# EAGLE schematic Keyboard Controller (EAGLE 9.6.2)
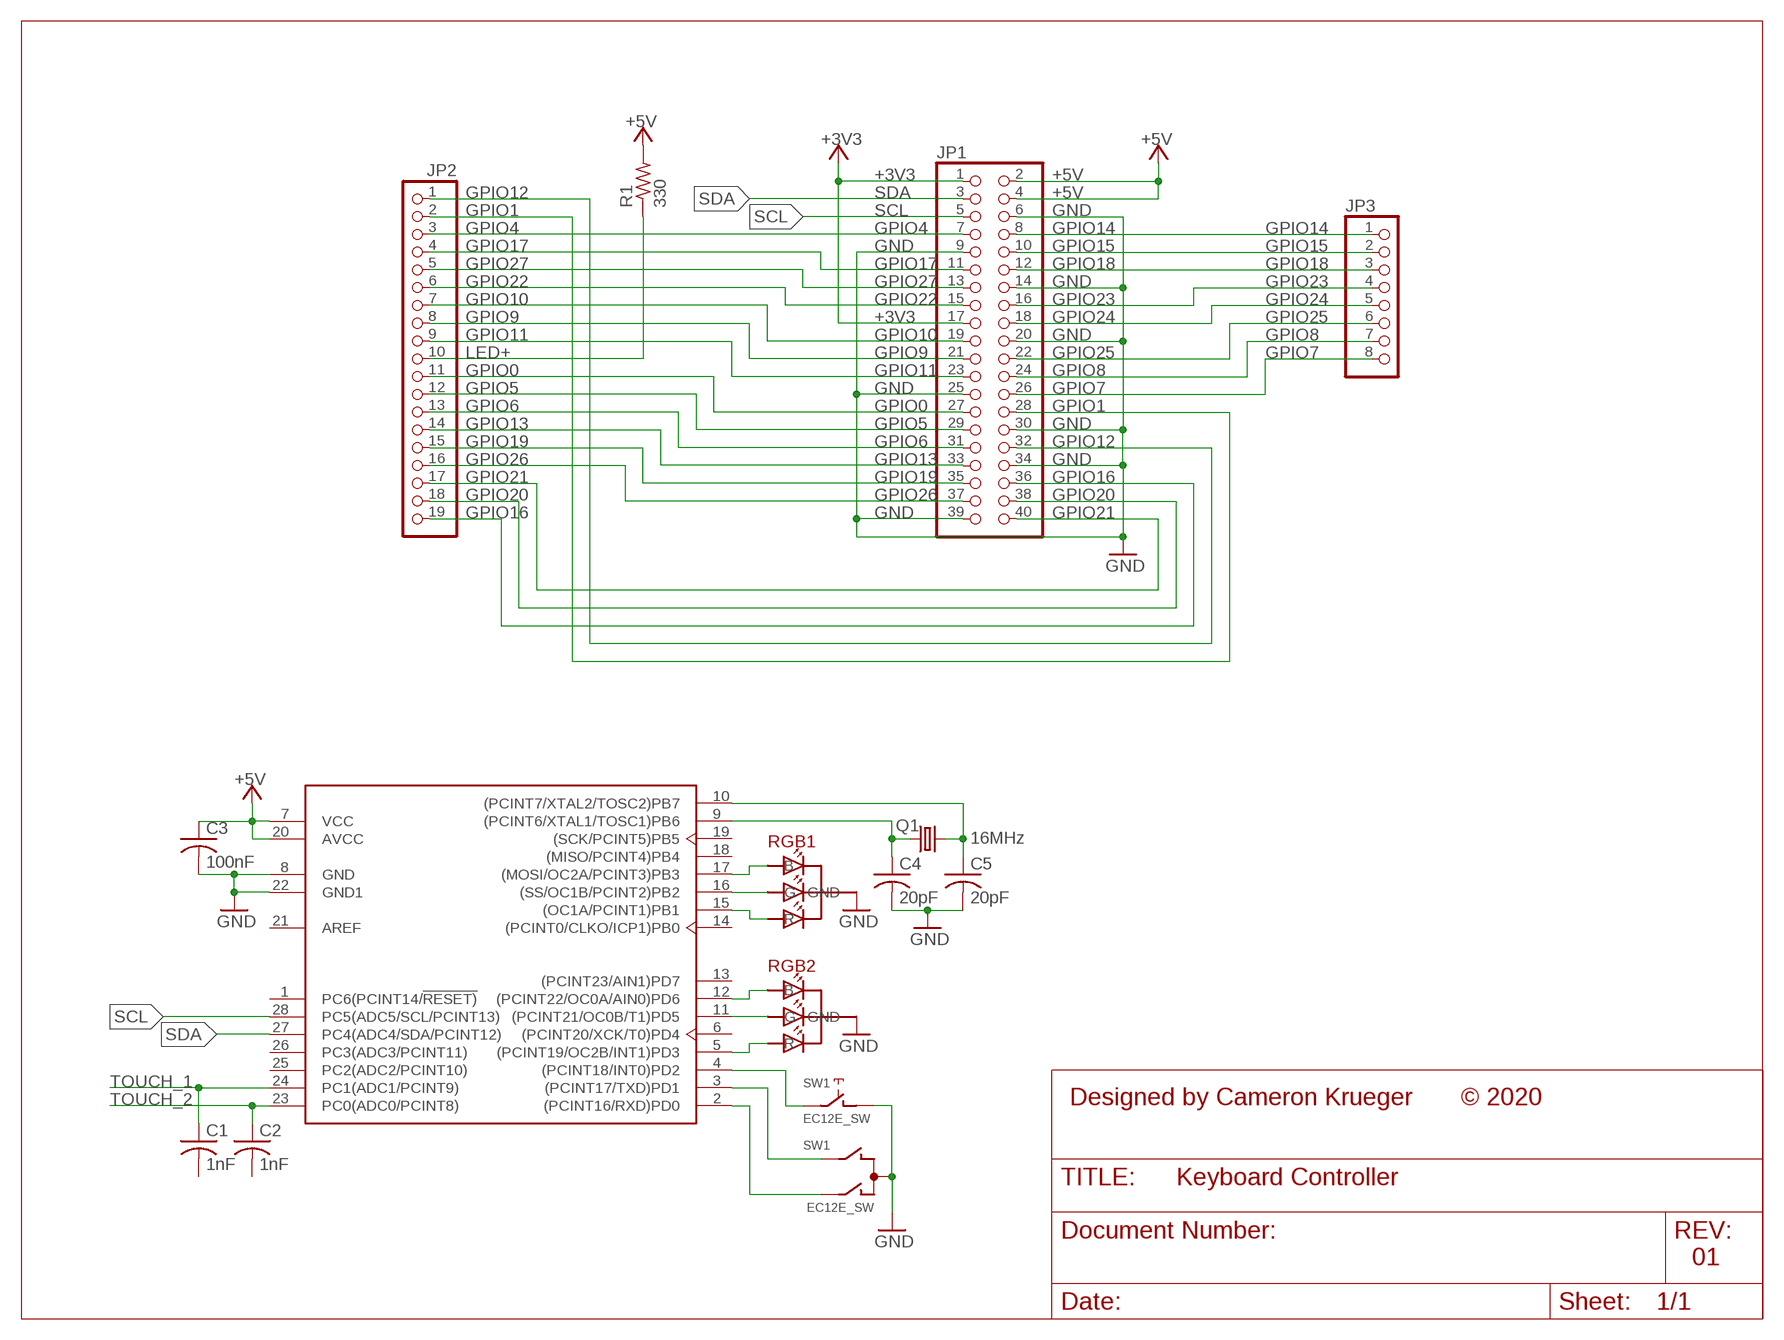
[diagram p0: schematic, sheet 1]

## Parts
C1  1nF  C-US025-030X050  [C025-030X050]
C2  1nF  C-US025-030X050  [C025-030X050]
C3  100nF  C-US050-024X044  [C050-024X044]
C4  20pF  C-US025-030X050  [C025-030X050]
C5  20pF  C-US025-030X050  [C025-030X050]
JP1  PINHD-2X20  [2X20]
JP2  PINHD-1X19  [1X19]
JP3  PINHD-1X8  [1X08]
Q1  16MHz  CRYSTALHC49U-V  [HC49U-V]
R1  330  R-US_0207/10  [0207/10]
RGB1  5MMRGBLED  [LED5MMRGB]
RGB2  5MMRGBLED  [LED5MMRGB]
SW1  EC12E_SW  [ALPS_EC12E_SW]
U2  ATMEGA328P-PU  [DIP-28]

## Nets
+3V3: JP1.1 JP1.17
+5V: C3.1 JP1.2 JP1.4 R1.2 U2.7(VCC) U2.20(AVCC)
GND: C3.2 C4.2 C5.2 JP1.6 JP1.9 JP1.14 JP1.20 JP1.25 JP1.30 JP1.34 JP1.39 RGB1.P$3(GND) RGB2.P$3(GND) SW1.C SW1.D U2.8(GND) U2.22(GND1)
GPIO0: JP1.27 JP2.11
GPIO1: JP1.28 JP2.2
GPIO4: JP1.7 JP2.3
GPIO5: JP1.29 JP2.12
GPIO6: JP1.31 JP2.13
GPIO7: JP1.26 JP3.8
GPIO8: JP1.24 JP3.7
GPIO9: JP1.21 JP2.8
GPIO10: JP1.19 JP2.7
GPIO11: JP1.23 JP2.9
GPIO12: JP1.32 JP2.1
GPIO13: JP1.33 JP2.14
GPIO14: JP1.8 JP3.1
GPIO15: JP1.10 JP3.2
GPIO16: JP1.36 JP2.19
GPIO17: JP1.11 JP2.4
GPIO18: JP1.12 JP3.3
GPIO19: JP1.35 JP2.15
GPIO20: JP1.38 JP2.18
GPIO21: JP1.40 JP2.17
GPIO22: JP1.15 JP2.6
GPIO23: JP1.16 JP3.4
GPIO24: JP1.18 JP3.5
GPIO25: JP1.22 JP3.6
GPIO26: JP1.37 JP2.16
GPIO27: JP1.13 JP2.5
LED+: JP2.10 R1.1
N$1: RGB2.P$4(R) U2.5((PCINT19/OC2B/INT1)PD3)
N$2: SW1.E U2.4((PCINT18/INT0)PD2)
N$4: SW1.B U2.3((PCINT17/TXD)PD1)
N$5: SW1.A U2.2((PCINT16/RXD)PD0)
N$6: RGB2.P$2(G) U2.11((PCINT21/OC0B/T1)PD5)
N$7: RGB2.P$1(B) U2.12((PCINT22/OC0A/AIN0)PD6)
N$8: RGB1.P$2(G) U2.16((SS/OC1B/PCINT2)PB2)
N$9: RGB1.P$1(B) U2.17((MOSI/OC2A/PCINT3)PB3)
N$10: RGB1.P$4(R) U2.15((OC1A/PCINT1)PB1)
N$11: C4.1 Q1.1 U2.9((PCINT6/XTAL1/TOSC1)PB6)
N$12: C5.1 Q1.2 U2.10((PCINT7/XTAL2/TOSC2)PB7)
SCL: JP1.5 U2.28(PC5(ADC5/SCL/PCINT13))
SDA: JP1.3 U2.27(PC4(ADC4/SDA/PCINT12))
TOUCH_1: C1.1 U2.24(PC1(ADC1/PCINT9))
TOUCH_2: C2.1 U2.23(PC0(ADC0/PCINT8))
Unconnected: C1.2 C2.2 SW1.GND1(G) SW1.GND2(G) U2.1(PC6(PCINT14/!RESET)) U2.6((PCINT20/XCK/T0)PD4) U2.13((PCINT23/AIN1)PD7) U2.14((PCINT0/CLKO/ICP1)PB0) U2.18((MISO/PCINT4)PB4) U2.19((SCK/PCINT5)PB5) U2.21(AREF) U2.25(PC2(ADC2/PCINT10)) U2.26(PC3(ADC3/PCINT11))

## Notes on the sheet
- Designed by Cameron Krueger | © 2020
- 01

## Library data of the parts
C1-C5 = rcl:C-US: CAPACITOR, American symbol; SPICEPREFIX: C
JP1 = pinhead:PINHD-2X20: PIN HEADER
JP2 = pinhead:PINHD-1X19: PIN HEADER
JP3 = pinhead:PINHD-1X8: PIN HEADER
Q1 = crystal:CRYSTAL: CRYSTAL; OC_FARNELL: 1666969; OC_NEWARK: unknown
R1 = rcl:R-US_: RESISTOR, American symbol; SPICEPREFIX: R
RGB1 RGB2 = led_rgb:5MMRGBLED
SW1 = switch-alps:EC12E_SW: ALPS rotary Encoder EC12E series with switch; MPN: EC12E2424407; OC_FARNELL: 1520813; OC_NEWARK: 74M1068
U2 = Microcontroller:ATMEGA328P-PU: IC MCU 8BIT 32KB FLASH 28DIP Manufacturer's datasheet <http://ww1.microchip.com/downloads/en/DeviceDoc/ATmega48A-PA-88A-PA-168A-PA-328-P-DS-DS40002061A.pdf>; CREATED_BY: PCBLayout.com; DIGIKEY_PART_NUMBER: ATMEGA328P-PU-ND; MANUFACTURER: Microchip Technology; MPN: ATMEGA328P-PU; PACKAGE: DIP-28